# Altium schematic sheet Keyswitches.SchDoc: Key Switches & LED
size B; Date: 7/22/2023; Revision: 01; SheetNumber: 4; SheetTotal: 4
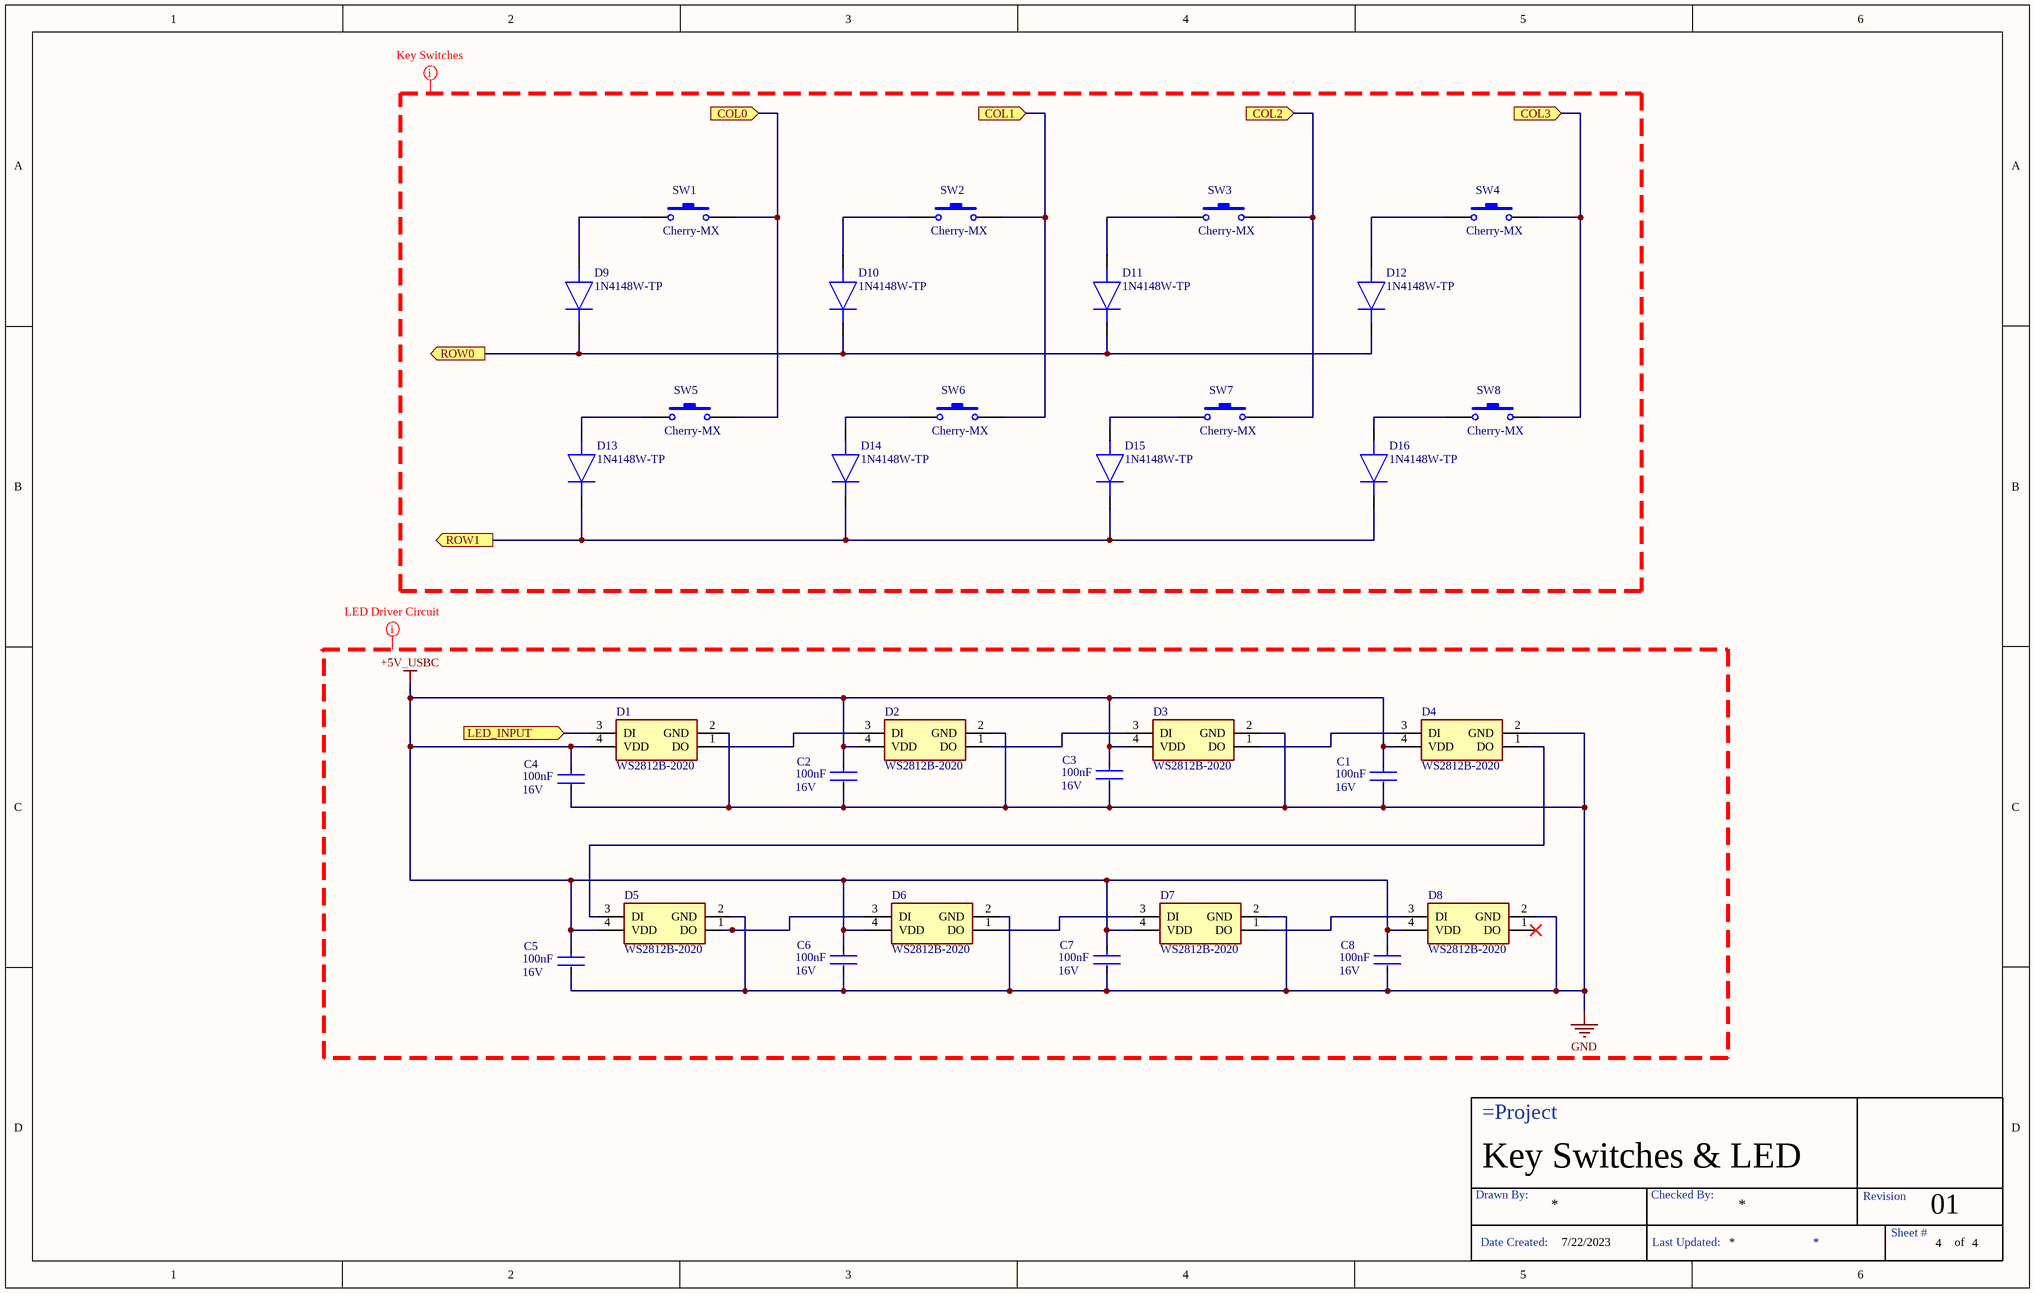
[diagram p0: Keyswitches.SchDoc]

## Parts
?  Title Block  (value not drawn)
C1  Voltage Rating: 16V  Capacitance: 100nF  [FP-GRM15-MFG]  (hidden comment: GRM155R71C104KA88D)
C2  Voltage Rating: 16V  Capacitance: 100nF  [FP-GRM15-MFG]  (hidden comment: GRM155R71C104KA88D)
C3  Voltage Rating: 16V  Capacitance: 100nF  [FP-GRM15-MFG]  (hidden comment: GRM155R71C104KA88D)
C4  Voltage Rating: 16V  Capacitance: 100nF  [FP-GRM15-MFG]  (hidden comment: GRM155R71C104KA88D)
C5  Voltage Rating: 16V  Capacitance: 100nF  [FP-GRM15-MFG]  (hidden comment: GRM155R71C104KA88D)
C6  Voltage Rating: 16V  Capacitance: 100nF  [FP-GRM15-MFG]  (hidden comment: GRM155R71C104KA88D)
C7  Voltage Rating: 16V  Capacitance: 100nF  [FP-GRM15-MFG]  (hidden comment: GRM155R71C104KA88D)
C8  Voltage Rating: 16V  Capacitance: 100nF  [FP-GRM15-MFG]  (hidden comment: GRM155R71C104KA88D)
D1  WS2812B-2020  [WS2812B2020]
D2  WS2812B-2020  [WS2812B2020]
D3  WS2812B-2020  [WS2812B2020]
D4  WS2812B-2020  [WS2812B2020]
D5  WS2812B-2020  [WS2812B2020]
D6  WS2812B-2020  [WS2812B2020]
D7  WS2812B-2020  [WS2812B2020]
D8  WS2812B-2020  [WS2812B2020]
D9  1N4148W-TP  [SOD3715X135N]
D10  1N4148W-TP  [SOD3715X135N]
D11  1N4148W-TP  [SOD3715X135N]
D12  1N4148W-TP  [SOD3715X135N]
D13  1N4148W-TP  [SOD3715X135N]
D14  1N4148W-TP  [SOD3715X135N]
D15  1N4148W-TP  [SOD3715X135N]
D16  1N4148W-TP  [SOD3715X135N]
SW1  Cherry-MX  [CHERRYMX_1.00U_HOTSWAP_NOSILK]
SW2  Cherry-MX  [CHERRYMX_1.00U_HOTSWAP_NOSILK]
SW3  Cherry-MX  [CHERRYMX_1.00U_HOTSWAP_NOSILK]
SW4  Cherry-MX  [CHERRYMX_1.00U_HOTSWAP_NOSILK]
SW5  Cherry-MX  [CHERRYMX_1.00U_HOTSWAP_NOSILK]
SW6  Cherry-MX  [CHERRYMX_1.00U_HOTSWAP_NOSILK]
SW7  Cherry-MX  [CHERRYMX_1.00U_HOTSWAP_NOSILK]
SW8  Cherry-MX  [CHERRYMX_1.00U_HOTSWAP_NOSILK]

## Ports
COL0 (in), COL1 (in), COL2 (in), COL3 (in), LED_INPUT (in), ROW0 (out), ROW1 (out)

## Nets
+5V_USBC: C1.2 C2.2 C3.2 C4.2 C5.2 C6.2 C7.2 C8.2 D1.4(VDD) D2.4(VDD) D3.4(VDD) D4.4(VDD) D5.4(VDD) D6.4(VDD) D7.4(VDD) D8.4(VDD)
GND: C1.1 C2.1 C3.1 C4.1 C5.1 C6.1 C7.1 C8.1 D1.2(GND) D2.2(GND) D3.2(GND) D4.2(GND) D5.2(GND) D6.2(GND) D7.2(GND) D8.2(GND)
COL0: SW1.2 SW5.2 ; port COL0
COL1: SW2.2 SW6.2 ; port COL1
COL2: SW3.2 SW7.2 ; port COL2
COL3: SW4.2 SW8.2 ; port COL3
LED_INPUT: D1.3(DI) ; port LED_INPUT
ROW0: D9.1(K) D10.1(K) D11.1(K) D12.1(K) ; port ROW0
ROW1: D13.1(K) D14.1(K) D15.1(K) D16.1(K) ; port ROW1
NetD1_1: D1.1(DO) D2.3(DI)
NetD2_1: D2.1(DO) D3.3(DI)
NetD3_1: D3.1(DO) D4.3(DI)
NetD4_1: D4.1(DO) D5.3(DI)
NetD5_1: D5.1(DO) D6.3(DI)
NetD6_1: D6.1(DO) D7.3(DI)
NetD7_1: D7.1(DO) D8.3(DI)
NetD9_2: D9.2(A) SW1.1
NetD10_2: D10.2(A) SW2.1
NetD11_2: D11.2(A) SW3.1
NetD12_2: D12.2(A) SW4.1
NetD13_2: D13.2(A) SW5.1
NetD14_2: D14.2(A) SW6.1
NetD15_2: D15.2(A) SW7.1
NetD16_2: D16.2(A) SW8.1

Not connected (* = marked no-connect by the designer): D8 1(DO)*

## Layout directives
mark named LED Driver Circuit: +5V_USBC, GND
mark named Key Switches: (no net found under the mark)

## Notes on the sheet
- (in symbol Title Block) Drawn By:; Checked By:; Revision; Sheet #; Date Created:; Last Updated:; of

## Library data of the parts
C1-C8 = CMP-2100-03641-2: CAP CER 0.1UF 16V X7R 0402; Manufacturer: Murata; Standoff Height: 0mm; Tolerance: 10%; Description: CAP Ceramic 0.10μF 10% X7R 16Vdc 0402 SMD; Material: Ceramic; Value: 0.10μF; RoHS: TRUE; Manufacturer Part Number: GRM155R71C104KA88D; Temperature Characteristic: X7R; Octopart: https://octopart.com/grm155r71c104ka88d-murata-196880; Digikey Description: CAP CER 0.1UF 16V X7R 0402; Device Class L3: Ceramic Capacitors; Height: 0.55mm; ComponentLink2Description: Datasheet; Temperature Range Low: -55°C; Ipc Land Pattern Name: CAPC10050X219; ComponentLink2URL: https://search.murata.co.jp/Ceramy/image/img/A01X/G101/ENG/GRM155R71H471KA01-01A.pdf; Device Class L1: Passive Components; Lead Free: yes; Category: Cap; Package: GRM15; Temperature: -55°C to +125°C; Device Class L2: Capacitors; Temperature Range High: +125°C; Mouser Description: 0402 0.1 uF 16V ±10 % Tolerance X7R SMT Multilayer Ceramic Capacitor
D1-D8 = WS2812B-2020: LED (Multiple); Manufacturer_Name: Worldsemi; Datasheet Link: https://www.alldatasheet.com/datasheet-pdf/pdf/1134522/WORLDSEMI/WS2812B-2020.html; Height: 0.84mm; Manufacturer_Part_Number: WS2812B-2020
D9-D16 = 1N4148W-TP: Diode; Manufacturer_Name: MCC; Datasheet Link: https://mccsemi.com/pdf/Products/1N4148W(SOD-123).pdf; Height: 1.35mm; Manufacturer_Part_Number: 1N4148W-TP; Mouser Part Number: 833-1N4148W-TP; Mouser Price/Stock: https://www.mouser.co.uk/ProductDetail/Micro-Commercial-Components-MCC/1N4148W-TP?qs=KFo7JewZbUH7wCMabJ4EeQ%3D%3D; Arrow Part Number: 1N4148W-TP; Arrow Price/Stock: https://www.arrow.com/en/products/1n4148w-tp/micro-commercial-components?region=europe